# Altium schematic sheet power.SchDoc: Power
size A3; Organization: GPA Robotics; DocumentNumber: 4; Revision: REV 0; SheetNumber: 4; SheetTotal: 11
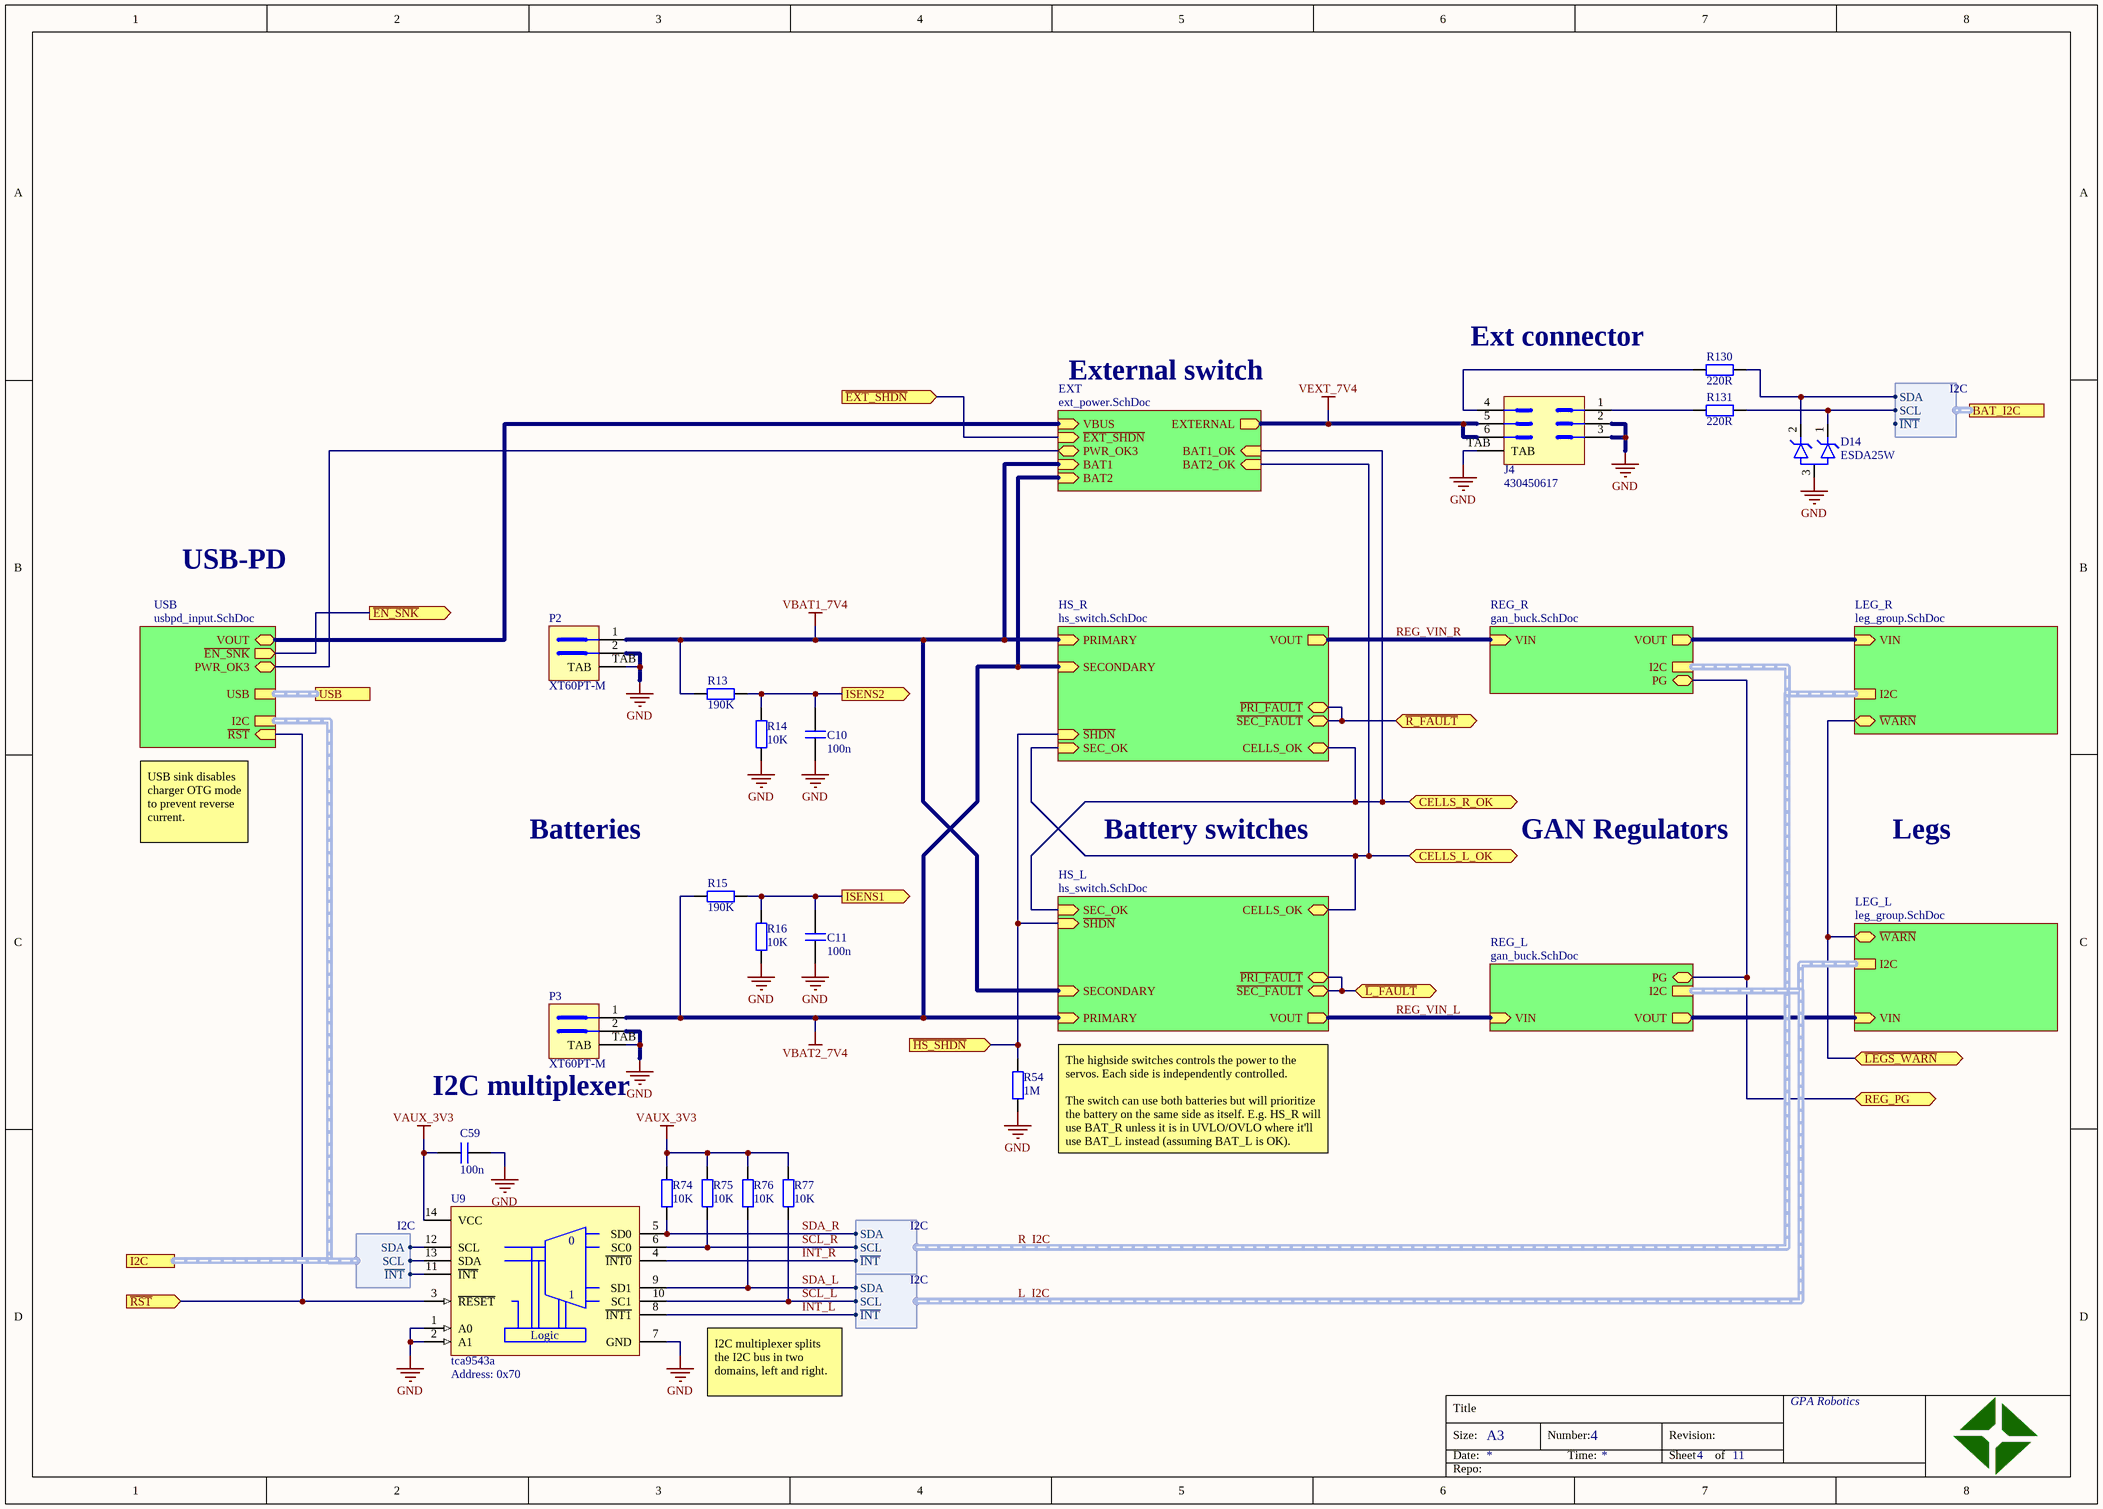
[diagram p0: power.SchDoc]

## Parts
C10  value 100n  [CAPC1005X06N]  (hidden comment: cap)
C11  value 100n  [CAPC1005X06N]  (hidden comment: cap)
C59  value 100n  [CAPC1005X06N]  (hidden comment: cap)
D14  ESDA25W  [SOT65P210X110-3N_SOT323-3L]
J4  430450617  [430450617]
P2  XT60PT-M  [XT60PT-M]
P3  XT60PT-M  [XT60PT-M]
R13  value 190K  [RESC1005X04N]  (hidden comment: res)
R14  value 10K  [RESC1005X04N]  (hidden comment: res)
R15  value 190K  [RESC1005X04N]  (hidden comment: res)
R16  value 10K  [RESC1005X04N]  (hidden comment: res)
R54  value 1M  [RESC1005X04N]  (hidden comment: res)
R74  value 10K  [RESC1005X04N]  (hidden comment: res)
R75  value 10K  [RESC1005X04N]  (hidden comment: res)
R76  value 10K  [RESC1005X04N]  (hidden comment: res)
R77  value 10K  [RESC1005X04N]  (hidden comment: res)
R130  value 220R  [RESC1005X04N]  (hidden comment: res)
R131  value 220R  [RESC1005X04N]  (hidden comment: res)
U9  tca9543a  Address: 0x70  [TSOP65P640X120-14N_PCA9543A]

## Sub-sheets
EXT = ext_power.SchDoc: BAT1 (in), BAT2 (in), VBUS (in), BAT1_OK (in), EXTERNAL (out), BAT2_OK (in), ~{EXT_SHDN} (in), PWR_OK3 (bidir)
HS_L = hs_switch.SchDoc: PRIMARY (in), SECONDARY (in), SEC_OK (in), CELLS_OK (bidir), VOUT (out), ~{SEC_FAULT} (bidir), ~{PRI_FAULT} (bidir), ~{SHDN} (in)
HS_R = hs_switch.SchDoc: PRIMARY (in), SECONDARY (in), SEC_OK (in), CELLS_OK (bidir), VOUT (out), ~{PRI_FAULT} (bidir), ~{SEC_FAULT} (bidir), ~{SHDN} (in)
LEG_L = leg_group.SchDoc: VIN (in), ~{WARN} (bidir), I2C (harness I2C)
LEG_R = leg_group.SchDoc: VIN (in), ~{WARN} (bidir), I2C (harness I2C)
REG_L = gan_buck.SchDoc: VOUT (out), VIN (in), PG (bidir), I2C (harness I2C)
REG_R = gan_buck.SchDoc: VOUT (out), VIN (in), PG (bidir), I2C (harness I2C)
USB = usbpd_input.SchDoc: VOUT (bidir), ~{RST} (in), ~{EN_SNK} (out), I2C (harness I2C), USB (harness USB), PWR_OK3 (bidir)

## Ports
BAT_I2C (harness I2C), CELLS_L_OK (bidir), CELLS_R_OK (bidir), I2C (harness I2C), ISENS1 (out), ISENS2 (out), REG_PG (bidir), USB (harness USB), ~{EN_SNK} (out), ~{EXT_SHDN} (in), ~{HS_SHDN} (in), ~{L_FAULT} (bidir), ~{LEGS_WARN} (bidir), ~{R_FAULT} (bidir), ~{RST} (in)

## Harnesses
I2C: SDA, SCL, ~{INT}

## Nets
GND: C10.1 C11.1 C59.2 D14.3 J4.2 J4.3 J4.TAB P2.2 P2.TAB P3.2 P3.TAB R14.1 R16.1 R54.1 U9.1(A0) U9.2(A1) U9.7(GND)
VAUX_3V3: C59.1 R74.2 R75.2 R76.2 R77.2 U9.14(VCC)
VBAT1_7V4: P2.1 R13.1 ; sheet EXT/BAT1, sheet HS_R/PRIMARY, sheet HS_L/SECONDARY
VBAT2_7V4: P3.1 R15.1 ; sheet EXT/BAT2, sheet HS_R/SECONDARY, sheet HS_L/PRIMARY
VEXT_7V4: J4.5 J4.6 ; sheet EXT/EXTERNAL
~{EN_SNK}: port ~{EN_SNK}, sheet USB/~{EN_SNK}
~{EXT_SHDN}: port ~{EXT_SHDN}, sheet EXT/~{EXT_SHDN}
~{HS_SHDN}: R54.2 ; port ~{HS_SHDN}, sheet HS_R/~{SHDN}, sheet HS_L/~{SHDN}
~{INT_L}: U9.8(~{INT1}) ; sheet LEG_L/I2C.~{INT}
~{INT_R}: U9.4(~{INT0}) ; sheet LEG_R/I2C.~{INT}
~{L_FAULT}: port ~{L_FAULT}, sheet HS_L/~{SEC_FAULT}, sheet HS_L/~{PRI_FAULT}
~{LEGS_WARN}: port ~{LEGS_WARN}, sheet LEG_R/~{WARN}, sheet LEG_L/~{WARN}
~{R_FAULT}: port ~{R_FAULT}, sheet HS_R/~{PRI_FAULT}, sheet HS_R/~{SEC_FAULT}
~{RST}: U9.3(~{RESET}) ; port ~{RST}, sheet USB/~{RST}
CELLS_L_OK: port CELLS_L_OK, sheet EXT/BAT2_OK, sheet HS_R/SEC_OK, sheet HS_L/CELLS_OK
CELLS_R_OK: port CELLS_R_OK, sheet EXT/BAT1_OK, sheet HS_R/CELLS_OK, sheet HS_L/SEC_OK
ISENS1: C11.2 R15.2 R16.2 ; port ISENS1
ISENS2: C10.2 R13.2 R14.2 ; port ISENS2
REG_PG: port REG_PG, sheet REG_R/PG, sheet REG_L/PG
REG_VIN_L: sheet HS_L/VOUT, sheet REG_L/VIN
REG_VIN_R: sheet HS_R/VOUT, sheet REG_R/VIN
SCL_L: R77.1 U9.10(SC1) ; sheet LEG_L/I2C.SCL  [project net L_I2C.SCL]
SCL_R: R75.1 U9.6(SC0) ; sheet LEG_R/I2C.SCL  [project net R_I2C.SCL]
SDA_L: R76.1 U9.9(SD1) ; sheet LEG_L/I2C.SDA  [project net L_I2C.SDA]
SDA_R: R74.1 U9.5(SD0) ; sheet LEG_R/I2C.SDA  [project net R_I2C.SDA]
NetD14_1: D14.1 R131.2 ; port BAT_I2C.SCL
NetD14_2: D14.2 R130.2 ; port BAT_I2C.SDA
NetJ4_1: J4.1 R131.1
NetJ4_4: J4.4 R130.1
NetU9_11: U9.11(~{INT}) ; port I2C.~{INT}
NetU9_12: U9.12(SCL) ; port I2C.SDA
NetU9_13: U9.13(SDA) ; port I2C.SCL
(unnamed): sheet EXT/VBUS, sheet USB/VOUT
(unnamed): sheet EXT/PWR_OK3, sheet USB/PWR_OK3
(unnamed): sheet LEG_R/VIN, sheet REG_R/VOUT
(unnamed): sheet LEG_L/VIN, sheet REG_L/VOUT

## Buses and harness runs
harness L_I2C = sheet LEG_L/I2C = sheet REG_L/I2C
harness port I2C = sheet USB/I2C
harness port USB = sheet USB/USB
harness R_I2C = sheet LEG_R/I2C = sheet REG_R/I2C

## Notes on the sheet
- External switch
- Ext connector
- USB-PD
- USB sink disables charger OTG mode to prevent reverse current.
- Batteries
- Battery switches
- GAN Regulators
- Legs
- (near P3) I2C multiplexer
- (near R54) The highside switches controls the power to the servos. Each side is independently controlled.
  The switch can use both batteries but will prioritize the battery on the same side as itself. E.g. HS_R will use BAT_R unless it is in UVLO/OVLO where it'll use BAT_L instead (assuming BAT_L is OK).
- I2C multiplexer splits the I2C bus in two domains, left and right.
- Title
- Size:
- Date:
- A3
- Number:
- Time:
- Revision:
- Sheet
- of
- Repo:
- (in symbol tca9543a) 0; Logic

## Library data of the parts
C10 C11 C59 = cap: Capacitor; voltage: *; type: *; #digikey: *; #mouser: *
D14 = esda25w: TRANSIL array for data protection; ComponentLink1Description: datasheet; ComponentLink1URL: https://www.st.com/content/ccc/resource/technical/document/datasheet/cd/9b/8d/39/1f/d4/43/ba/CD00064033.pdf/files/CD00064033.pdf/jcr:content/translations/en.CD00064033.pdf
J4 = 430450617: Micro-Fit 3.0 Vertical Header, 3.00mm Pitch, Dual Row, 6 Circuits, with PCB Press-fit Metal Retention Clip, Gold, Glow-Wire Capable, Black; ComponentLink1Description: drawing; ComponentLink1URL: https://www.molex.com/pdm_docs/sd/430450617_sd.pdf
R13-R16 R54 R74-R77 R130 R131 = res: Resistor; power: *; voltage: *; #digikey: *; #mouser: *
U9 = tca9543a: Low Voltage 2-Channel I2C Bus Switch With Interrupt Logic And Reset; ComponentLink1Description: datasheet; ComponentLink1URL: http://www.ti.com/lit/ds/symlink/tca9543a.pdf